# Altium schematic sheet IMX385_EVB_revA.SchDoc
size B; SheetNumber: 1; SheetTotal: 3
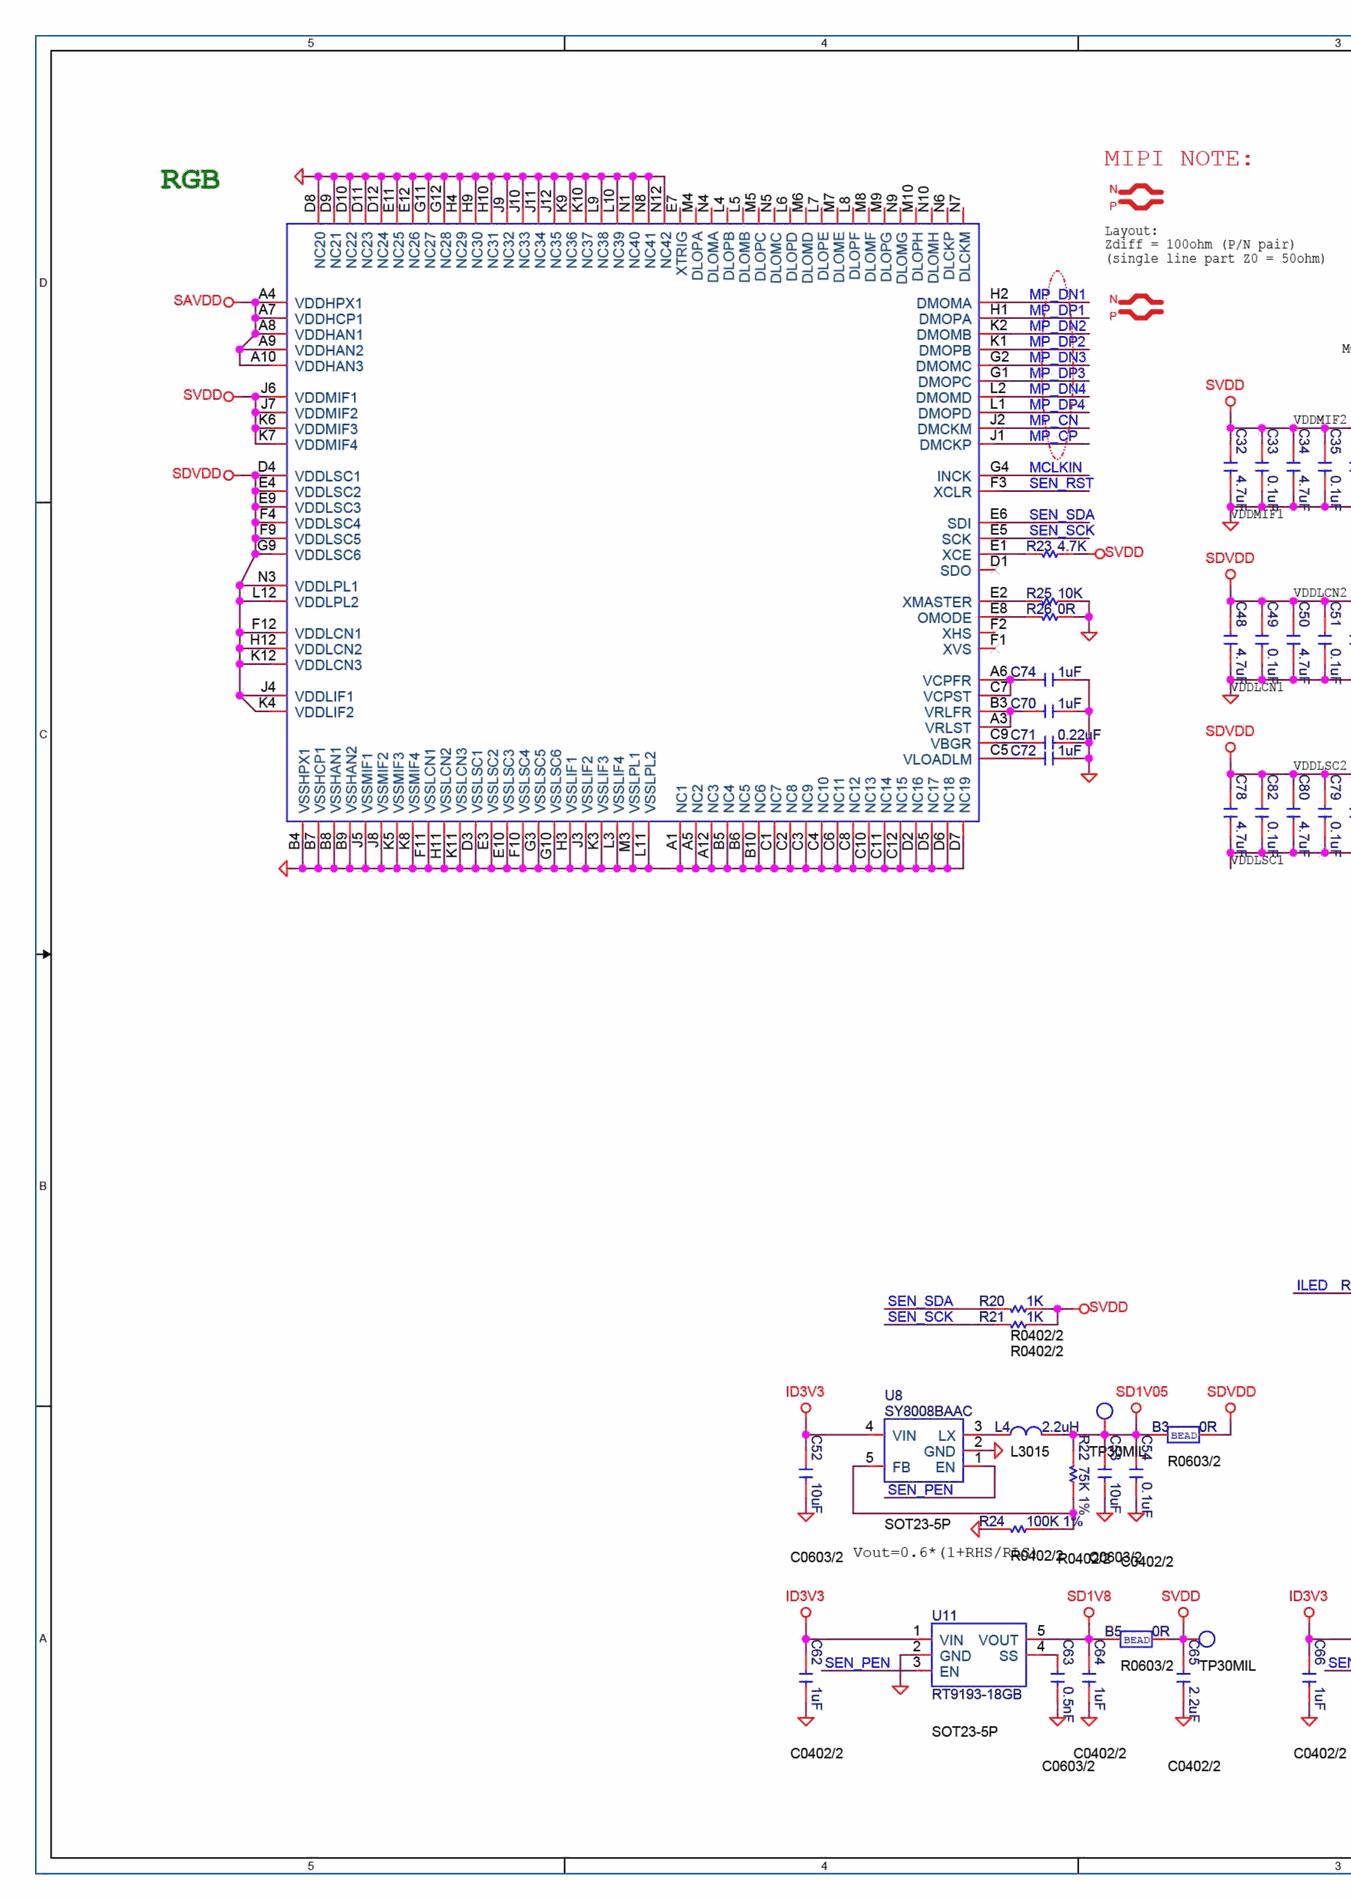
[diagram p0: IMX385_EVB_revA.SchDoc, top left]
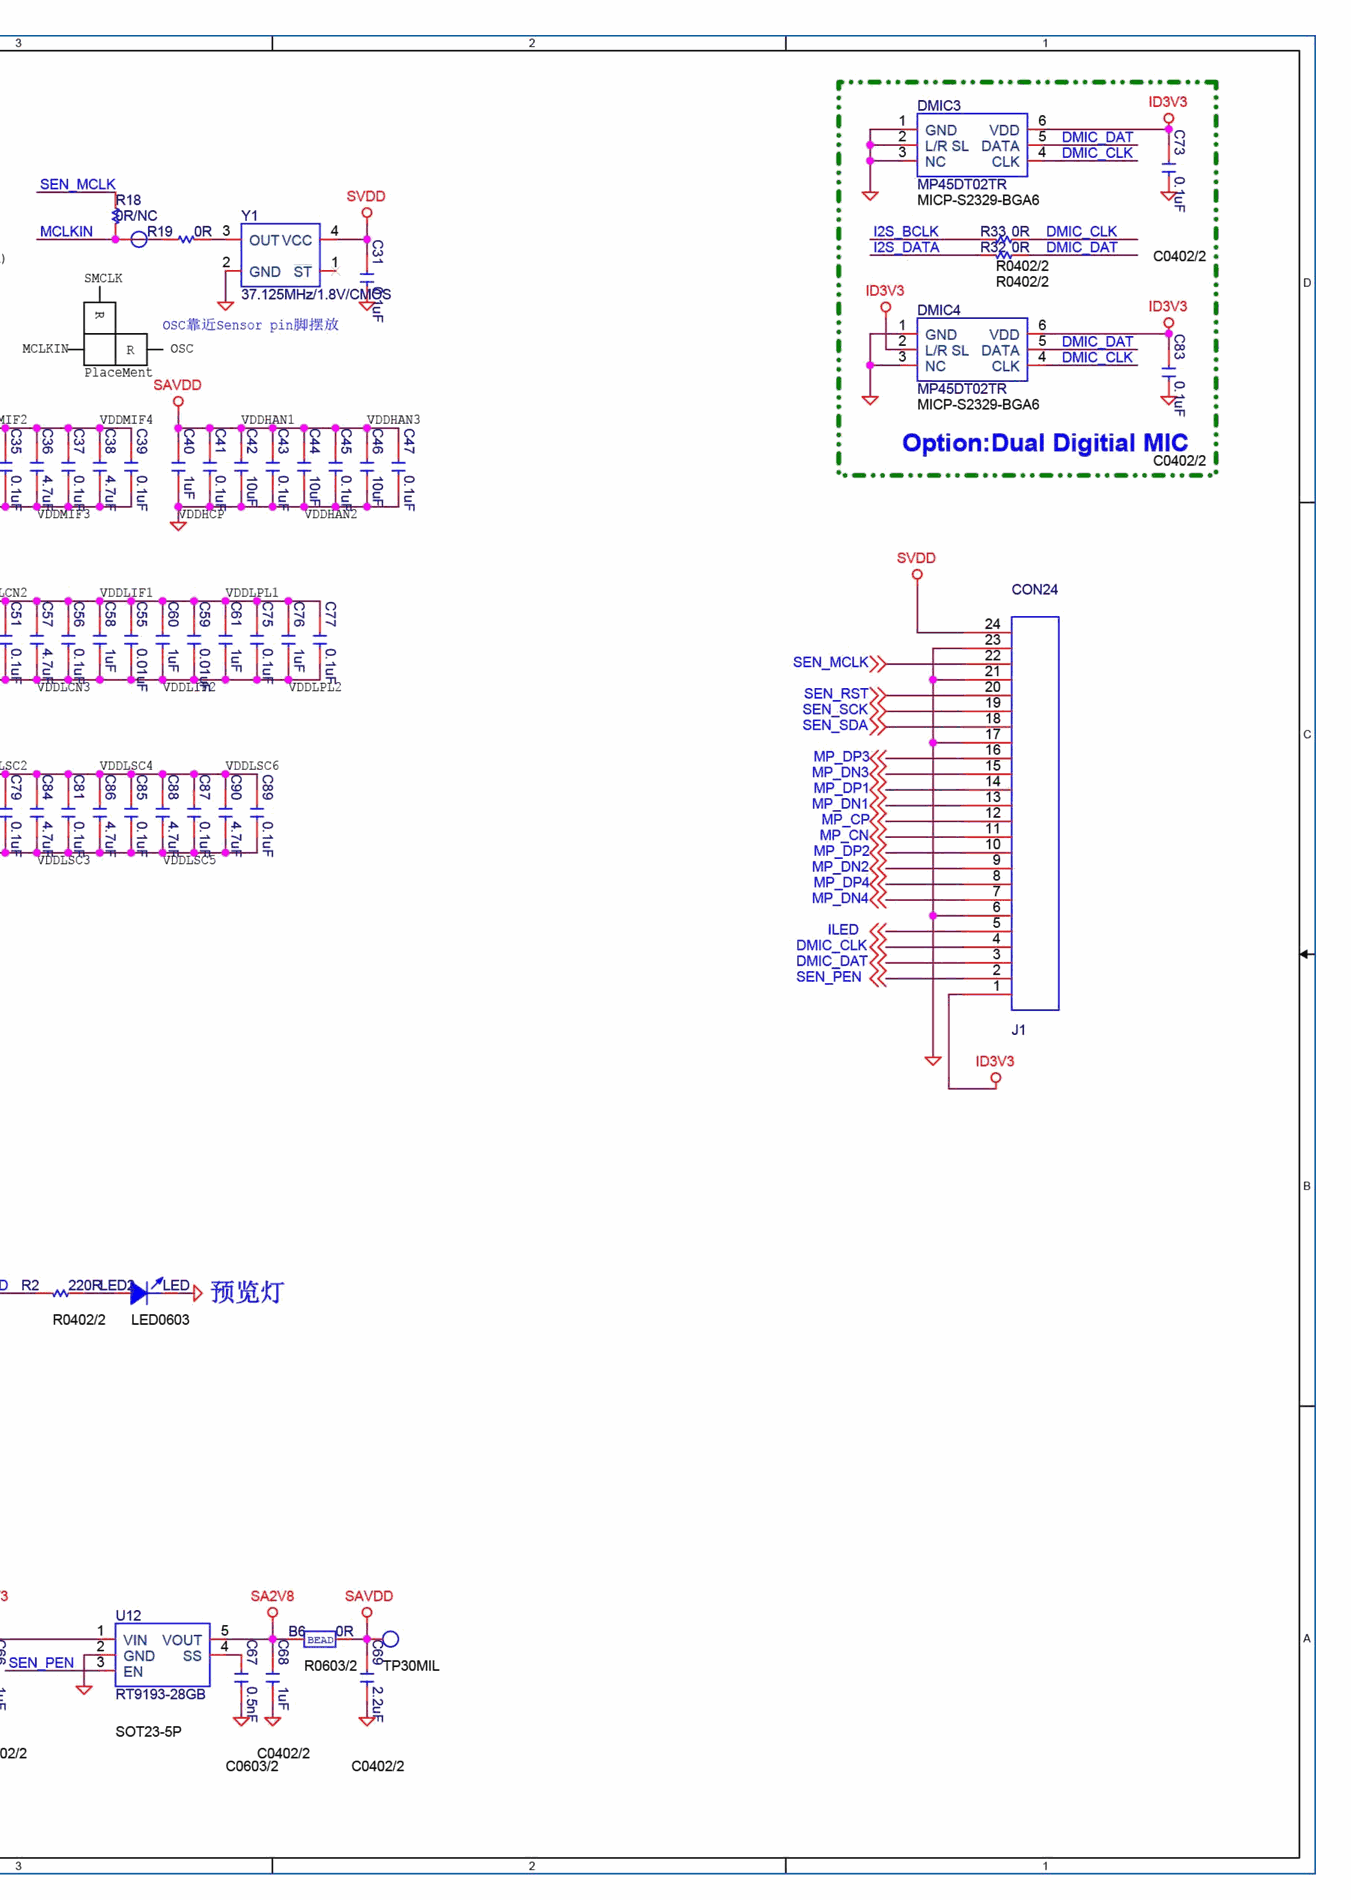
[diagram p1: IMX385_EVB_revA.SchDoc, top right]
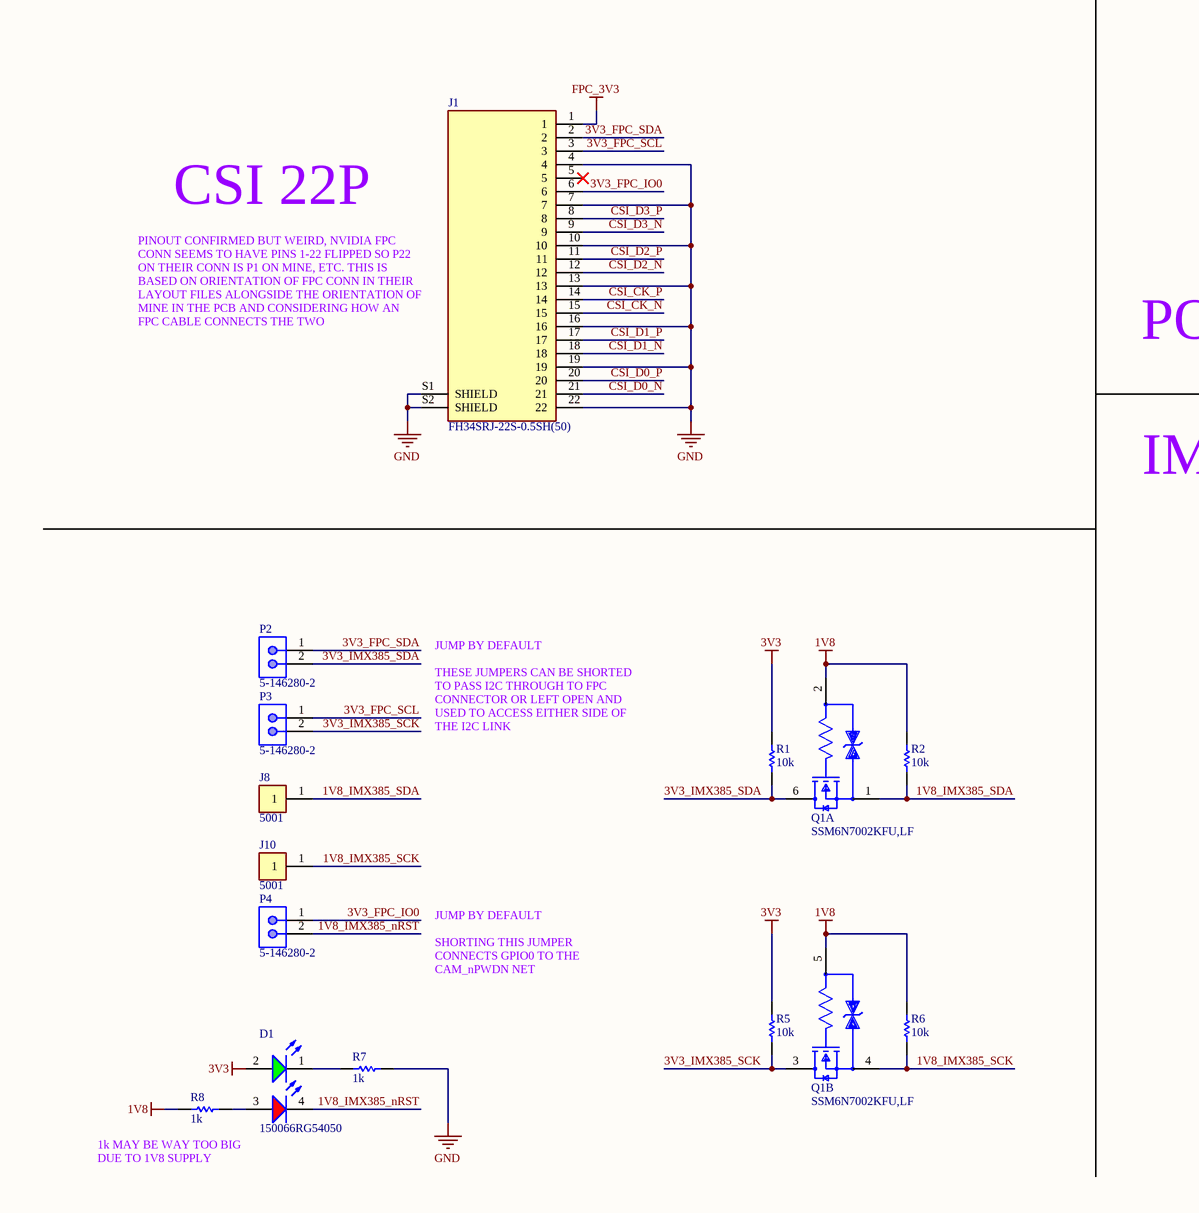
[diagram p2: IMX385_EVB_revA.SchDoc, bottom left]
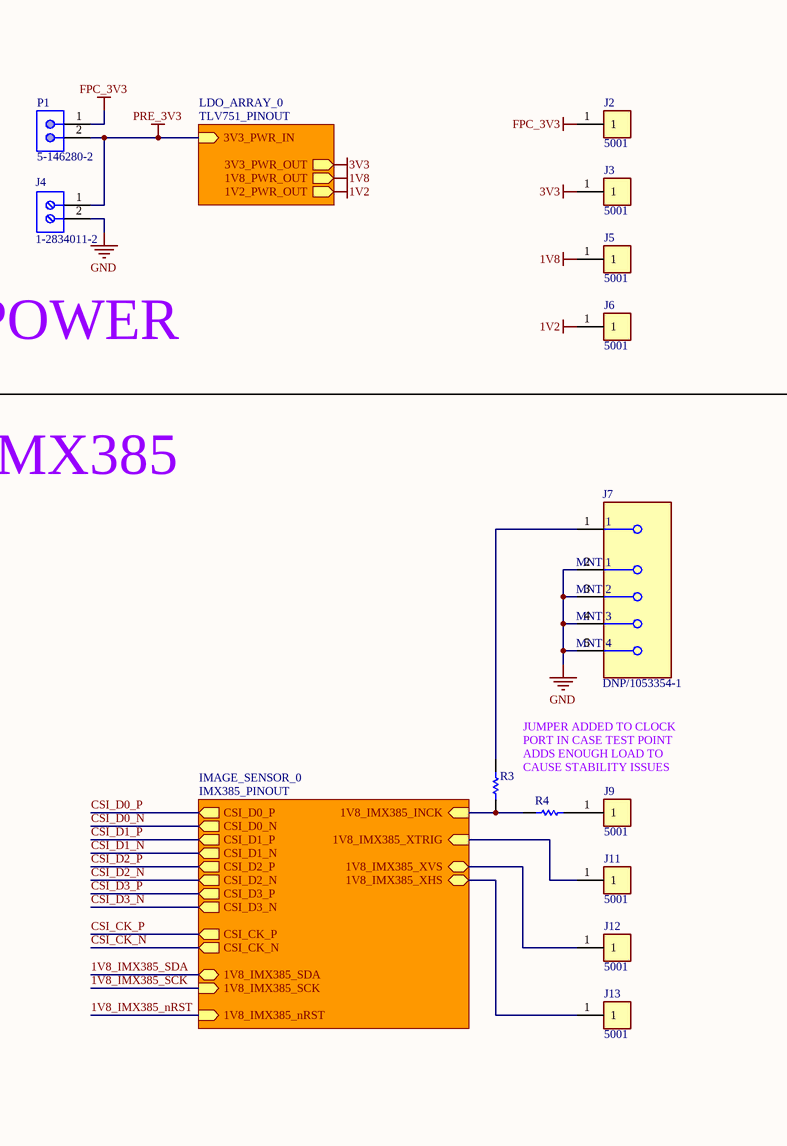
[diagram p3: IMX385_EVB_revA.SchDoc, bottom right]

## Parts
D1  150066RG54050  [WL-SBCD_0606]
J1  FH34SRJ-22S-0.5SH(50)  [FH34SRJ-22S-0.5SH(50)-Footprint-1]
J2  5001  [FP-5001-MFG]
J3  5001  [FP-5001-MFG]
J4  1-2834011-2  [1-2834011-2-Footprint-1]
J5  5001  [FP-5001-MFG]
J6  5001  [FP-5001-MFG]
J7  DNP/1053354-1  [FP-1053354-1-MFG]
J8  5001  [FP-5001-MFG]
J9  5001  [FP-5001-MFG]
J10  5001  [FP-5001-MFG]
J11  5001  [FP-5001-MFG]
J12  5001  [FP-5001-MFG]
J13  5001  [FP-5001-MFG]
P1  5-146280-2  [TECO-5-146280-2_V]
P2  5-146280-2  [TECO-5-146280-2_V]
P3  5-146280-2  [TECO-5-146280-2_V]
P4  5-146280-2  [TECO-5-146280-2_V]
Q1  SSM6N7002KFU,LF  [FP-SSOP6-P-0_65A-MFG]  (parts A,B of 2)
R1  10k  [R0603B]
R2  10k  [R0603B]
R3  DNP  [RESC1005X40X25ML05T05]  (value not drawn)
R4  0402 JUMPER  [RESC1005X40X25ML05T05]  (value not drawn)
R5  10k  [R0603B]
R6  10k  [R0603B]
R7  1k  [R0603B]
R8  1k  [R0603B]

## Sub-sheets
IMAGE_SENSOR_0 = IMX385_PINOUT: CSI_D0_P (out), CSI_D0_N (out), CSI_D1_P (out), CSI_D1_N (out), CSI_D2_P (out), CSI_D2_N (out), CSI_D3_P (out), CSI_D3_N (out), CSI_CK_P (out), CSI_CK_N (out), 1V8_IMX385_SDA (bidir), 1V8_IMX385_SCK (in), 1V8_IMX385_nRST (in), 1V8_IMX385_INCK (in), 1V8_IMX385_XHS (bidir), 1V8_IMX385_XVS (bidir), 1V8_IMX385_XTRIG (in)
LDO_ARRAY_0 = TLV751_PINOUT: 3V3_PWR_IN (in), 1V2_PWR_OUT (out), 1V8_PWR_OUT (out), 3V3_PWR_OUT (out)

## Nets
1V2: J6.1 ; sheet LDO_ARRAY_0/1V2_PWR_OUT
1V8: J5.1 Q1.2(Gate1) Q1.5(Gate2) R2.2 R6.2 R8.2 ; sheet LDO_ARRAY_0/1V8_PWR_OUT
3V3: D1.2(A) J3.1 R1.2 R5.2 ; sheet LDO_ARRAY_0/3V3_PWR_OUT
FPC_3V3: J1.1 J2.1 P1.1
GND: J1.4 J1.7 J1.10 J1.13 J1.16 J1.19 J1.22 J1.S1(SHIELD) J1.S2(SHIELD) J4.2 J7.2(MNT_1) J7.3(MNT_2) J7.4(MNT_3) J7.5(MNT_4) R7.1
PRE_3V3: J4.1 P1.2 ; sheet LDO_ARRAY_0/3V3_PWR_IN
1V8_IMX385_nRST: D1.4(K) P4.2 ; sheet IMAGE_SENSOR_0/1V8_IMX385_nRST
1V8_IMX385_SCK: J10.1 Q1.4(Source2) R6.1 ; sheet IMAGE_SENSOR_0/1V8_IMX385_SCK
1V8_IMX385_SDA: J8.1 Q1.1(Source1) R2.1 ; sheet IMAGE_SENSOR_0/1V8_IMX385_SDA
3V3_FPC_IO0: J1.6 P4.1
3V3_FPC_SCL: J1.3 P3.1
3V3_FPC_SDA: J1.2 P2.1
3V3_IMX385_SCK: P3.2 Q1.3(Drain2) R5.1
3V3_IMX385_SDA: P2.2 Q1.6(Drain1) R1.1
CSI_CK_N: J1.15 ; sheet IMAGE_SENSOR_0/CSI_CK_N
CSI_CK_P: J1.14 ; sheet IMAGE_SENSOR_0/CSI_CK_P
CSI_D0_N: J1.21 ; sheet IMAGE_SENSOR_0/CSI_D0_N
CSI_D0_P: J1.20 ; sheet IMAGE_SENSOR_0/CSI_D0_P
CSI_D1_N: J1.18 ; sheet IMAGE_SENSOR_0/CSI_D1_N
CSI_D1_P: J1.17 ; sheet IMAGE_SENSOR_0/CSI_D1_P
CSI_D2_N: J1.12 ; sheet IMAGE_SENSOR_0/CSI_D2_N
CSI_D2_P: J1.11 ; sheet IMAGE_SENSOR_0/CSI_D2_P
CSI_D3_N: J1.9 ; sheet IMAGE_SENSOR_0/CSI_D3_N
CSI_D3_P: J1.8 ; sheet IMAGE_SENSOR_0/CSI_D3_P
NetD1_1: D1.1(K) R7.2
NetD1_3: D1.3(A) R8.1
NetJ7_1: J7.1 R3.2
NetJ9_1: J9.1 R4.2
NetJ11_1: J11.1 ; sheet IMAGE_SENSOR_0/1V8_IMX385_XTRIG
NetJ12_1: J12.1 ; sheet IMAGE_SENSOR_0/1V8_IMX385_XVS
NetJ13_1: J13.1 ; sheet IMAGE_SENSOR_0/1V8_IMX385_XHS
NetR3_1: R3.1 R4.1 ; sheet IMAGE_SENSOR_0/1V8_IMX385_INCK

Not connected (* = marked no-connect by the designer): J1 5*

## Notes on the sheet
- CSI 22P
- (near J1) PINOUT CONFIRMED BUT WEIRD, NVIDIA FPC CONN SEEMS TO HAVE PINS 1-22 FLIPPED SO P22 ON THEIR CONN IS P1 ON MINE, ETC. THIS IS BASED ON ORIENTATION OF FPC CONN IN THEIR LAYOUT FILES ALONGSIDE THE ORIENTATION OF MINE IN THE PCB AND CONSIDERING HOW AN FPC CABLE CONNECTS THE TWO
- POWER
- IMX385
- JUMP BY DEFAULT
  THESE JUMPERS CAN BE SHORTED TO PASS I2C THROUGH TO FPC CONNECTOR OR LEFT OPEN AND USED TO ACCESS EITHER SIDE OF THE I2C LINK
- JUMPER ADDED TO CLOCK PORT IN CASE TEST POINT ADDS ENOUGH LOAD TO CAUSE STABILITY ISSUES
- JUMP BY DEFAULT
  SHORTING THIS JUMPER CONNECTS GPIO0 TO THE CAM_nPWDN NET
- 1k MAY BE WAY TOO BIG DUE TO 1V8 SUPPLY

## Library data of the parts
D1 = CMP-004-00040-2: Led, Red/Grn, 180Mcd/230Mcd, 624Nm/525Nm Rohs Compliant: Yes; Source: rgled.SchLib; Component Type: Standard; Design Item ID: CMP-004-00034-2; Pins: 4
J1 = CMP-002-00104-1: 0.5Mm Pitch, 1.0Mm Height, Top And Bottom Contact, Back-Flip; Connector Type: Receptacle; Pins: 22; Min Operating Temperature: -55°C; Max Operating Temperature: 105°C; Mounting Technology: Surface Mount
J2 J3 J5 J6 J8-J13 = CMP-2000-05181-2: PC TEST POINT MINIATURE BLACK; Body Material: Bronze; Plating: Silver; Inside Diameter: 1.27mm; Hole Diameter: 1.6mm; Number of Ports: 1; Outside Diameter: 2.54mm; Insulation: Insulated; Insulation Material: Nylon; Mount: Through Hole; RoHS Compliant: Yes; Series: THM; Height: 0.3inch; Termination: Through Hole; Material: Nylon; Packaging: Bulk; Contact Material: Bronze; REACH SVHC: No SVHC; Contact Plating: Silver; Orientation: Straight; Lead Free: Lead Free; Package Quantity: 100; Length: 7.62mm; Flammability Rating: UL94 V-0; Number of Contacts: 1; Diameter: 2.54mm; Housing Color: Black; Color: Black
J4 = CMP-002-00067-1: Barrier Strip Terminal Block; RoHS Compliant: Yes
J7 = CMP-2000-05830-2: CONN SMA JACK STR 50 OHM PCB; Dielectric Material: PTFE; Impedance: 50R; Frequency: 18GHz; Polarity: Normal; Body Material: Stainless Steel; Max Frequency: 12.4GHz; Center Contact Plating: Gold; PCB Mounting Orientation: Vertical; Mating Cycles: 500; Gender: Female; Number of Ports: 1; Packaging: Bag; Contact Plating: Gold; REACH SVHC: No SVHC; Radiation Hardening: No; Mount: Through Hole; Fastening Type: Threaded; Package Quantity: 125; Connector Type: SMA; Operating Frequency: N/A; Height: 9.5mm; Plating: Gold; RoHS Compliant: Yes; Insulation Material: Polytetrafluoroethylene; Length: 9.53mm; Contact Material: Copper; Orientation: Straight; Case/Package: SMA; Depth: 6.3mm; Series: SMA; Termination: Solder; Housing Color: Gold; Body Plating: Gold
P1-P4 = CMP-2000-07492-1: Male Header, Pitch 2.54 mm, 1 x 2 Position, Height 8.21 mm, Tail Length 3.05 mm, -65 to 105 degC, RoHS, Bulk; Manufacturer: TE Connectivity; Mating Connector Lock: No(Without); Number of Positions: 2; Pitch: 2.54mm; PCB Mounting Orientation: Vertical; Keyed: No; Case\/Package: 100; Mating Post Length: 0.23inch; High Temperature Housing: Yes; Max Current Rating: 5A; PCB Thickness: 0.063inch; PCB Mount Retention: Without; Approvals: CSA; Current Rating: 3A; Radiation Hardening: No; Length: 4.67mm; Contact Mating Length: 0.23inch; Connector Type: Header; Number of Rows: 1; Termination Post Length: 0.12inch; Board Standoff: No(Without); Max Operating Temperature: 105degC; Contact Shape: Square; Selectively Loaded: No(Without); Gasket: No(Without); Number of Contacts: 2; Contact Gender: Male; Mating Alignment: No(Without); Manufacturer URL: http://www.te.com/; Datasheet URL: http://www.te.com/commerce/DocumentDelivery/DDEController?Action=showdoc&DocId=Customer+Drawing%7F146280%7FH1%7Fpdf%7FEnglish%7FENG_CD_146280_H1.pdf%7F5-146280-2; Mount: ThroughHole; Orientation: Straight; Packaging: Carton; Package Reference: 5-146280-2; Package Quantity: 500; Stabilizers: No(Without); Row Spacing: 2.54mm; Contact Material: CopperAlloy; Panel Mount Retention: No(Without); Datasheet Version: Rev. H1, 08/2016; Housing Colour: Black; Colour: Black; Package Description: Male Header, Pitch 2.54 mm, 1 x 2 Position, Height 8.21 mm, Tail Length 3.05 mm; Contact Plating: Matte; Housing Material: Polymer; Contact Protection: No(Without); Min Operating Temperature: -65degC; Mounting Technology: ThroughHole; Flammability Rating: UL94V-0; RoHSCompliant: true; Termination: ThroughHole; Depth: 2.34mm; High Speed Serial Data Connector: No
Q1 = CMP-35916-000009-1: MOSFET 2N-CH 60V 0.3A; Input Capacitance: 40pF; Continuous Drain Current (ID): 300mA; Max Power Dissipation: 285mW; FET Type: 2 N-Channel; Rds On Max: 1.5R; Mount: Surface Mount; Drain to Source Voltage (Vdss): 60V; Packaging: Tape and Reel
R1 R2 R5-R8 = CMP-009-00002-14: Resistor
  R1 R2 R5 R6: Value: 10k
R3 R4 = CMP-009-00118-2: READ THE NAME; Pins: 2; Component Type: Standard; Design Item ID: CMP-009-00206-2; Source: 0402jump.SchLib